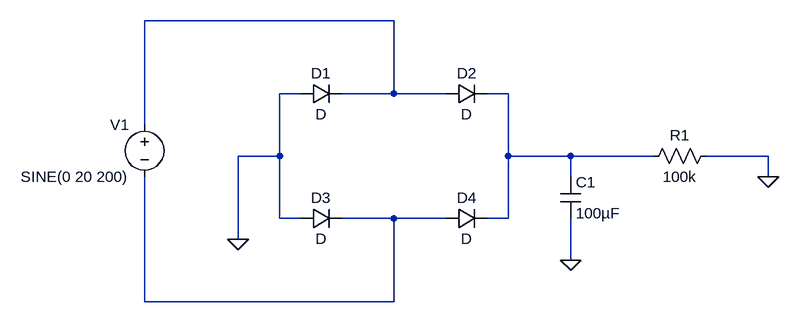
[diagram p0: schematic Full Bridge Rectifier.asc]
Full Bridge Rectifier.asc, the LTspice schematic file:
Version 4
SHEET 1 880 680
WIRE 256 -64 -128 -64
WIRE 112 48 80 48
WIRE 256 48 256 -64
WIRE 256 48 176 48
WIRE 336 48 256 48
WIRE 432 48 400 48
WIRE -128 96 -128 -64
WIRE 80 144 80 48
WIRE 80 144 16 144
WIRE 432 144 432 48
WIRE 528 144 432 144
WIRE 656 144 528 144
WIRE 832 144 736 144
WIRE 528 176 528 144
WIRE 832 176 832 144
WIRE 80 240 80 144
WIRE 112 240 80 240
WIRE 256 240 176 240
WIRE 336 240 256 240
WIRE 432 240 432 144
WIRE 432 240 400 240
WIRE 16 272 16 144
WIRE 528 304 528 240
WIRE -128 368 -128 176
WIRE 256 368 256 240
WIRE 256 368 -128 368
FLAG 16 272 0
FLAG 832 176 0
FLAG 528 304 0
SYMBOL voltage -128 80 M0
WINDOW 123 0 0 Left 0
WINDOW 39 0 0 Left 0
SYMATTR InstName V1
SYMATTR Value SINE(0 20 200)
SYMBOL diode 112 64 R270
WINDOW 0 32 32 VTop 2
WINDOW 3 0 32 VBottom 2
SYMATTR InstName D1
SYMBOL diode 336 64 R270
WINDOW 0 32 32 VTop 2
WINDOW 3 0 32 VBottom 2
SYMATTR InstName D2
SYMBOL diode 112 256 R270
WINDOW 0 32 32 VTop 2
WINDOW 3 0 32 VBottom 2
SYMATTR InstName D3
SYMBOL diode 336 256 R270
WINDOW 0 32 32 VTop 2
WINDOW 3 0 32 VBottom 2
SYMATTR InstName D4
SYMBOL res 752 128 R90
WINDOW 0 0 56 VBottom 2
WINDOW 3 32 56 VTop 2
SYMATTR InstName R1
SYMATTR Value 100k
SYMBOL cap 512 176 R0
SYMATTR InstName C1
SYMATTR Value 100µF

The netlist it stands for:
* Full Bridge Rectifier.asc
V1 N001 N003 SINE(0 20 200)
D1 0 N001 D
D2 N001 N002 D
D3 0 N003 D
D4 N003 N002 D
R1 0 N002 100k
C1 N002 0 100µF
.model D D
.lib standard.dio
.backanno
.end